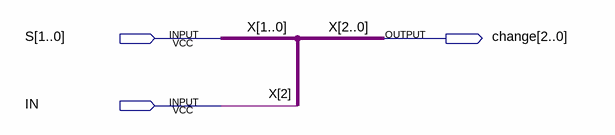
[diagram p0: schematic sheet]
// Quartus schematic chnage_2bitTo1.bdf as structural Verilog: 0 symbols, 3 pins
module chnage_2bitTo1 (
  input  [1:0] S,
  input  IN,
  output [2:0] change
);


  assign change = {IN, S};

  // Other names for the same wires on the sheet: X[2:0] = {IN, S}
endmodule
